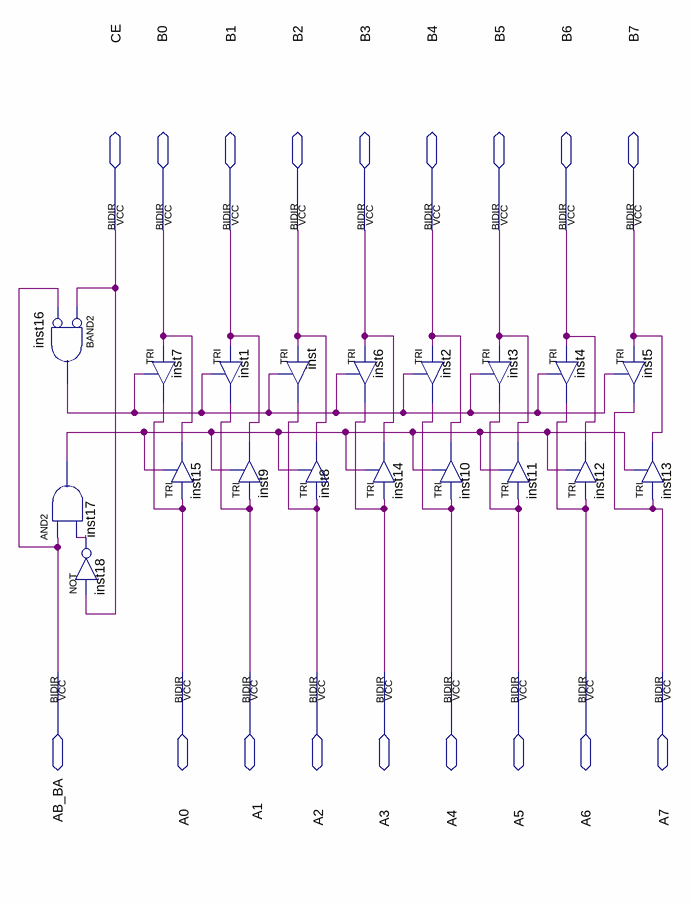
[diagram p0: schematic sheet]
// Quartus schematic ci_74LS245_octal_bus.bdf as structural Verilog: 19 symbols, 18 pins
module ci_74LS245_octal_bus (
  inout  CE,
  inout  B0,
  inout  B1,
  inout  B2,
  inout  B3,
  inout  B4,
  inout  B5,
  inout  B6,
  inout  B7,
  inout  AB_BA,
  inout  A0,
  inout  A1,
  inout  A2,
  inout  A3,
  inout  A4,
  inout  A5,
  inout  A6,
  inout  A7
);

  wire inst16_out, inst17_out, inst18_out;

  and inst16 (inst16_out, ~CE, ~AB_BA);  // BAND2
  and inst17 (inst17_out, AB_BA, inst18_out);
  not inst18 (inst18_out, CE);
  TRI inst7 (.IN(B0), .OE(inst16_out), .OUT(A0));
  TRI inst15 (.IN(A0), .OE(inst17_out), .OUT(B0));
  TRI inst1 (.IN(B1), .OE(inst16_out), .OUT(A1));
  TRI inst9 (.IN(A1), .OE(inst17_out), .OUT(B1));
  TRI inst (.IN(B2), .OE(inst16_out), .OUT(A2));
  TRI inst8 (.IN(A2), .OE(inst17_out), .OUT(B2));
  TRI inst6 (.IN(B3), .OE(inst16_out), .OUT(A3));
  TRI inst14 (.IN(A3), .OE(inst17_out), .OUT(B3));
  TRI inst2 (.IN(B4), .OE(inst16_out), .OUT(A4));
  TRI inst10 (.IN(A4), .OE(inst17_out), .OUT(B4));
  TRI inst3 (.IN(B5), .OE(inst16_out), .OUT(A5));
  TRI inst4 (.IN(B6), .OE(inst16_out), .OUT(A6));
  TRI inst11 (.IN(A5), .OE(inst17_out), .OUT(B5));
  TRI inst5 (.IN(B7), .OE(inst16_out), .OUT(A7));
  TRI inst12 (.IN(A6), .OE(inst17_out), .OUT(B6));
  TRI inst13 (.IN(A7), .OE(inst17_out), .OUT(B7));
endmodule
